# EAGLE design generic_maxi_speed_1 (EAGLE 6.3)
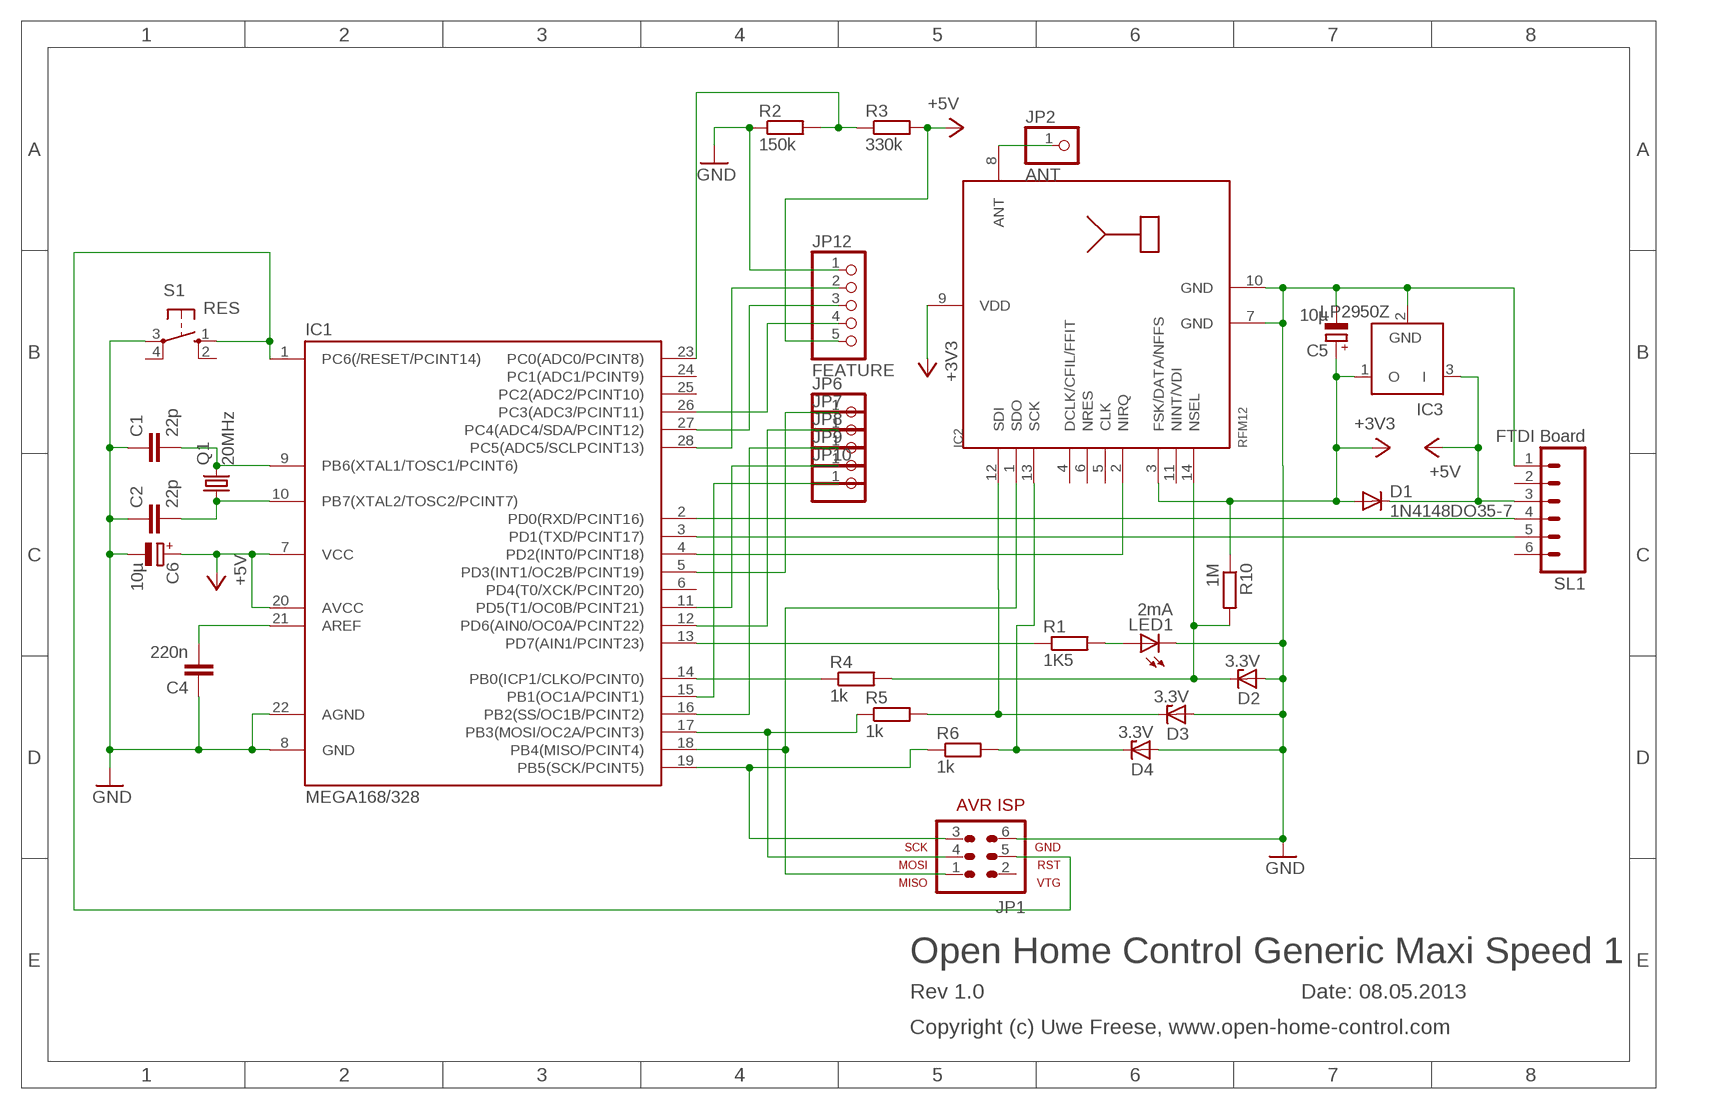
[diagram p0: schematic, sheet 1]

## Parts
C1  22p  C-EU025-024X044  [C025-024X044]
C2  22p  C-EU025-024X044  [C025-024X044]
C4  220n  C-EU025-030X050  [C025-030X050]
C5  10µ  CPOL-EUE1.8-4  [E1,8-4]
C6  10µ  CPOL-EUE1.8-4  [E1,8-4]
D1  1N4148DO35-7  [DO35-7]
D2  3.3V  ZENER-DIODEZD-5  [ZDIO-5]
D3  3.3V  ZENER-DIODEZD-5  [ZDIO-5]
D4  3.3V  ZENER-DIODEZD-5  [ZDIO-5]
IC1  MEGA168/328  MEGA48/88/168-PU  [DIL28-3]
IC2  RFM12  [RFM]
IC3  LP2950Z  [TO92]
JP1  AVR-ISP-6  [AVR-ISP-6]
JP2  ANT  PINHD-1X1  [1X01]
JP6  PINHD-1X1  [1X01]
JP7  PINHD-1X1  [1X01]
JP8  PINHD-1X1  [1X01]
JP9  PINHD-1X1  [1X01]
JP10  PINHD-1X1  [1X01]
JP12  FEATURE  PINHD-1X5  [1X05]
LED1  2mA  LED3MM  [LED3MM]
Q1  20MHz  CRYSTALHC49S  [HC49/S]
R1  1K5  R-EU_0207/7  [0207/7]
R2  150k  R-EU_0207/7  [0207/7]
R3  330k  R-EU_0207/7  [0207/7]
R4  1k  R-EU_0207/7  [0207/7]
R5  1k  R-EU_0207/7  [0207/7]
R6  1k  R-EU_0207/7  [0207/7]
R10  1M  R-EU_0207/7  [0207/7]
S1  RES  10-XX  [B3F-10XX]
SL1  FTDI Board  M06  [06P]

## Nets
+3V3: C5.+ D1.A IC2.3(FSK/DATA/NFFS) IC2.9(VDD) IC3.1(O) R10.1
+5V: C6.+ D1.C IC1.7(VCC) IC1.20(AVCC) IC3.3(I) JP12.5 R3.2 SL1.3
GND: C1.1 C2.1 C4.1 C5.- C6.- D2.A D3.A D4.A IC1.8(GND) IC1.22(AGND) IC2.7(GND) IC2.10(GND) IC3.2(GND) JP1.6 JP12.1 LED1.K(C) R2.1 S1.3(P) SL1.1
N$1: C1.2 IC1.9(PB6(XTAL1/TOSC1/PCINT6)) Q1.2
N$2: C2.2 IC1.10(PB7(XTAL2/TOSC2/PCINT7)) Q1.1
N$3: IC1.17(PB3(MOSI/OC2A/PCINT3)) JP1.4 R5.1
N$4: IC1.18(PB4(MISO/PCINT4)) IC2.1(SDO) JP1.1
N$5: D4.C IC2.13(SCK) R6.2
N$6: IC1.28(PC5(ADC5/SCLPCINT13)) JP12.2
N$7: IC1.19(PB5(SCK/PCINT5)) JP1.3 R6.1
N$8: IC1.1(PC6(/RESET/PCINT14)) JP1.5 S1.1(S)
N$9: IC1.3(PD1(TXD/PCINT17)) SL1.5
N$10: IC1.2(PD0(RXD/PCINT16)) SL1.4
N$11: IC1.27(PC4(ADC4/SDA/PCINT12)) JP12.3
N$12: LED1.A R1.2
N$14: IC1.26(PC3(ADC3/PCINT11)) JP12.4
N$15: IC1.4(PD2(INT0/PCINT18)) IC2.2(NIRQ)
N$16: D3.C IC2.12(SDI) R5.2
N$17: IC1.5(PD3(INT1/OC2B/PCINT19)) JP6.1
N$18: IC1.23(PC0(ADC0/PCINT8)) R2.2 R3.1
N$19: IC1.11(PD5(T1/OC0B/PCINT21)) JP9.1
N$20: IC1.12(PD6(AIN0/OC0A/PCINT22)) JP7.1
N$21: IC1.13(PD7(AIN1/PCINT23)) R1.1
N$22: IC1.15(PB1(OC1A/PCINT1)) JP10.1
N$23: IC1.16(PB2(SS/OC1B/PCINT2)) JP8.1
N$24: C4.2 IC1.21(AREF)
N$25: IC2.8(ANT) JP2.1
N$26: IC1.14(PB0(ICP1/CLKO/PCINT0)) R4.1
N$27: D2.C IC2.14(NSEL) R4.2 R10.2
Unconnected: IC1.6(PD4(T0/XCK/PCINT20)) IC1.24(PC1(ADC1/PCINT9)) IC1.25(PC2(ADC2/PCINT10)) IC2.4(DCLK/CFIL/FFIT) IC2.5(CLK) IC2.6(NRES) IC2.11(NINT/VDI) JP1.2 S1.2(S1) S1.4(P1) SL1.2 SL1.6

## Notes on the sheet
- Open Home Control Generic Maxi Speed 1
- Rev 1.0 | Date: 08.05.2013
- Copyright (c) Uwe Freese, www.open-home-control.com

## Library data of the parts
C1 C2 C4 = rcl:C-EU: CAPACITOR, European symbol
C5 C6 = rcl:CPOL-EU: POLARIZED CAPACITOR, European symbol
D1 = diode:1N4148: DIODE high speed (Philips)
D2-D4 = diode:ZENER-DIODE: Z-Diode
IC1 = avr-5-4.16:MEGA48/88/168-PU
IC2 = hopeRF:RFM12
IC3 = linear:LP2950: 100 mA, Low Power Low Dropout Voltage Regulator Source: http://www.onsemi.com/pub/Collateral/LP2950-D.PDF
JP1 = avr-5-4.16:AVR-ISP-6: AVR ISP-6 Serial Programming Header
JP2 JP6-JP10 = pinhead:PINHD-1X1: PIN HEADER
JP12 = pinhead:PINHD-1X5: PIN HEADER
LED1 = led:LED: LED OSRAM: - CHIPLED LG R971, LG N971, LY N971, LG Q971, LY Q971, LO R971, LY R971 LH N974, LH R974 LS Q976, LO Q976, LY Q976 LO Q996 - Hyper CHIPLED LW Q18S LB Q993, LB Q99A, LB R99A - SideLED LS A670, LO A670, LY A670, LG A670, LP A670 LB A673, LV A673, LT A673, LW A673 LH A674 LY A675 LS A676, LA A676, LO A676, LY A676, LW A676 LS A679, LY A679, LG A679 - Hyper Micro SIDELED® LS Y876, LA Y876, LO Y876, LY Y876 LT Y87S - SmartLED LW L88C, LW L88S LB L89C, LB L89S, LG L890 LS L89K, LO L89K, LY L89K LS L896, LA L896, LO L896, LY L896 - TOPLED LS T670, LO T670, LY T670, LG T670, LP T670 LSG T670, LSP T670, LSY T670, LOP T670, LYG T670 LG T671, LOG T671, LSG T671 LB T673, LV T673, LT T673, LW T673 LH T674 LS T676, LA T676, LO T676, LY T676, LB T676, LH T676, LSB T676, LW T676 LB T67C, LV T67C, LT T67C, LS T67K, LO T67K, LY T67K, LW E67C LS E67B, LA E67B, LO E67B, LY E67B, LB E67C, LV E67C, LT E67C LW T67C LS T679, LY T679, LG T679 LS T770, LO T770, LY T770, LG T770, LP T770 LB T773, LV T773, LT T773, LW T773 LH T774 LS E675, LA E675, LY E675, LS T675 LS T776, LA T776, LO T776, LY T776, LB T776 LHGB T686 LT T68C, LB T68C - Hyper Mini TOPLED® LB M676 - Mini TOPLED Santana® LG M470 LS M47K, LO M47K, LY M47K Source: http://www.osram.convergy.de LUXEON: - LUMILED® LXK2-PW12-R00, LXK2-PW12-S00, LXK2-PW14-U00, LXK2-PW14-V00 LXK2-PM12-R00, LXK2-PM12-S00, LXK2-PM14-U00 LXK2-PE12-Q00, LXK2-PE12-R00, LXK2-PE12-S00, LXK2-PE14-T00, LXK2-PE14-U00 LXK2-PB12-K00, LXK2-PB12-L00, LXK2-PB12-M00, LXK2-PB14-N00, LXK2-PB14-P00, LXK2-PB14-Q00 LXK2-PR12-L00, LXK2-PR12-M00, LXK2-PR14-Q00, LXK2-PR14-R00 LXK2-PD12-Q00, LXK2-PD12-R00, LXK2-PD12-S00 LXK2-PH12-R00, LXK2-PH12-S00 LXK2-PL12-P00, LXK2-PL12-Q00, LXK2-PL12-R00 Source: www.luxeon.com KINGBRIGHT: KA-3528ASYC Source: www.kingbright.com
Q1 = crystal:CRYSTAL: CRYSTAL; OC_FARNELL: 1667008; OC_NEWARK: unknown
R1-R6 R10 = rcl:R-EU_: RESISTOR, European symbol
S1 = switch-omron:10-XX: OMRON SWITCH; MPN: B3F-1000; OC_FARNELL: 176432; OC_NEWARK: 36M3542
SL1 = con-amp-quick:M06: AMP QUICK CONNECTOR; OC_FARNELL: unknown; OC_NEWARK: unknown

## Net classes
0 default: clearance 0.305 mm

## Board
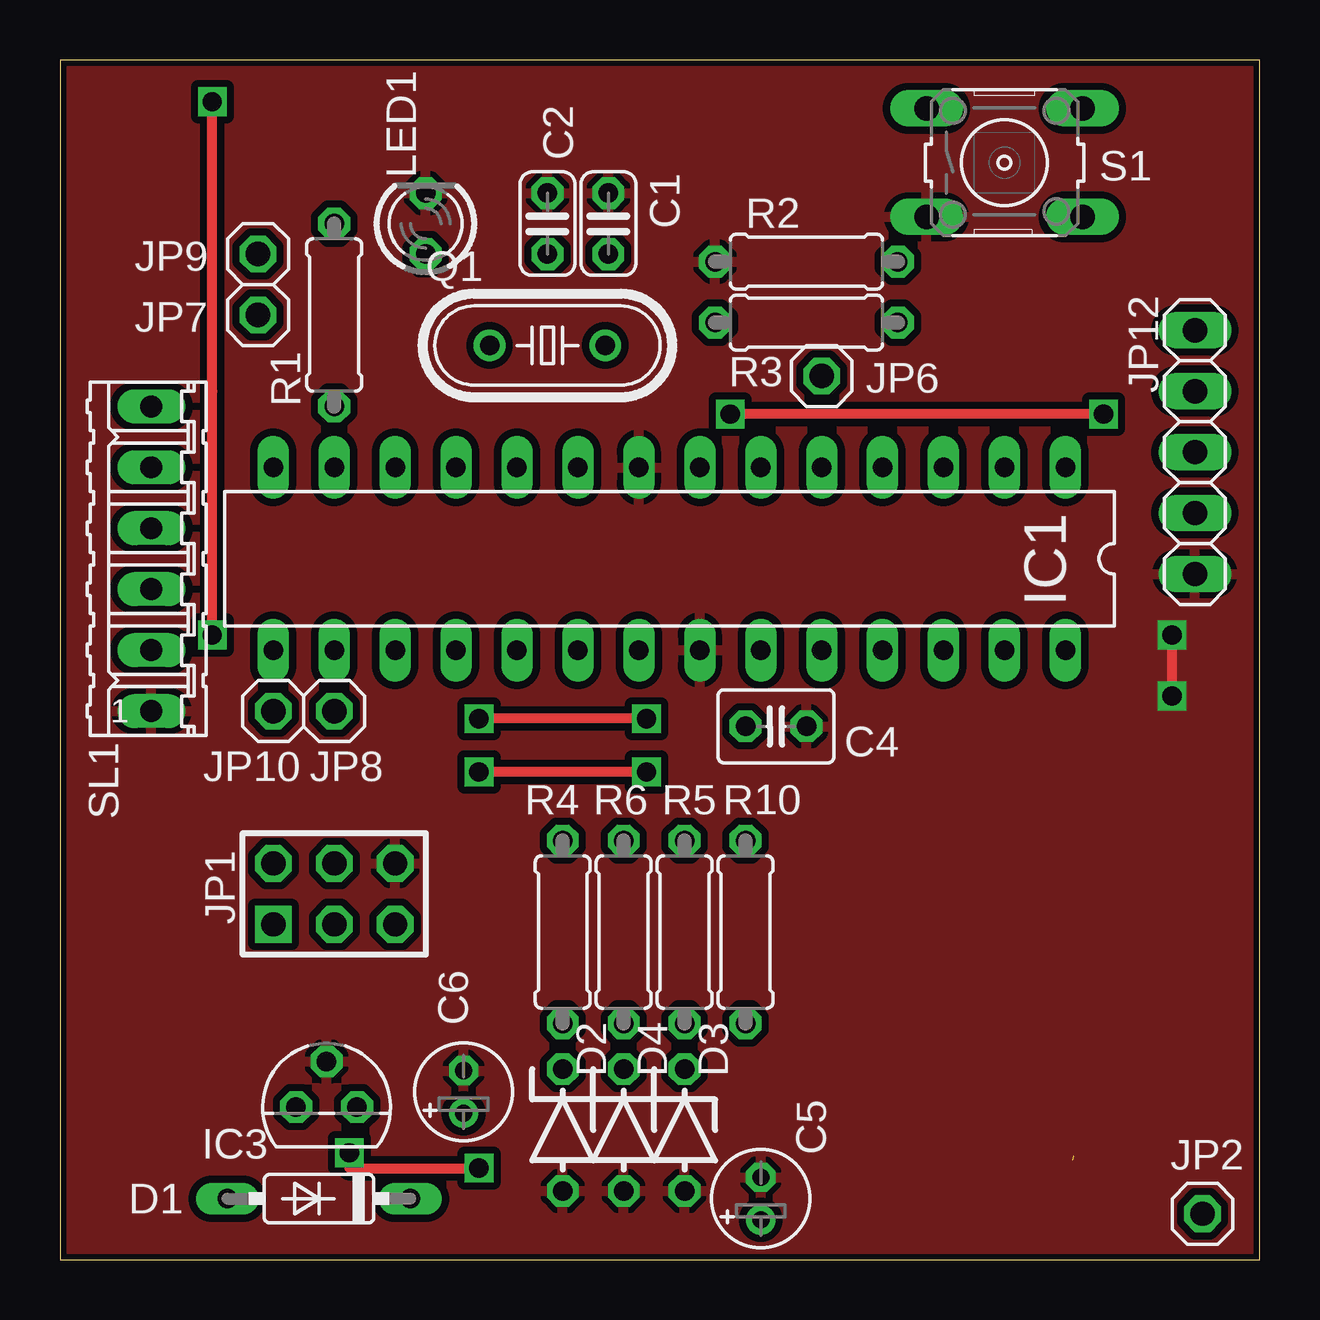
[diagram p1: board, top side]
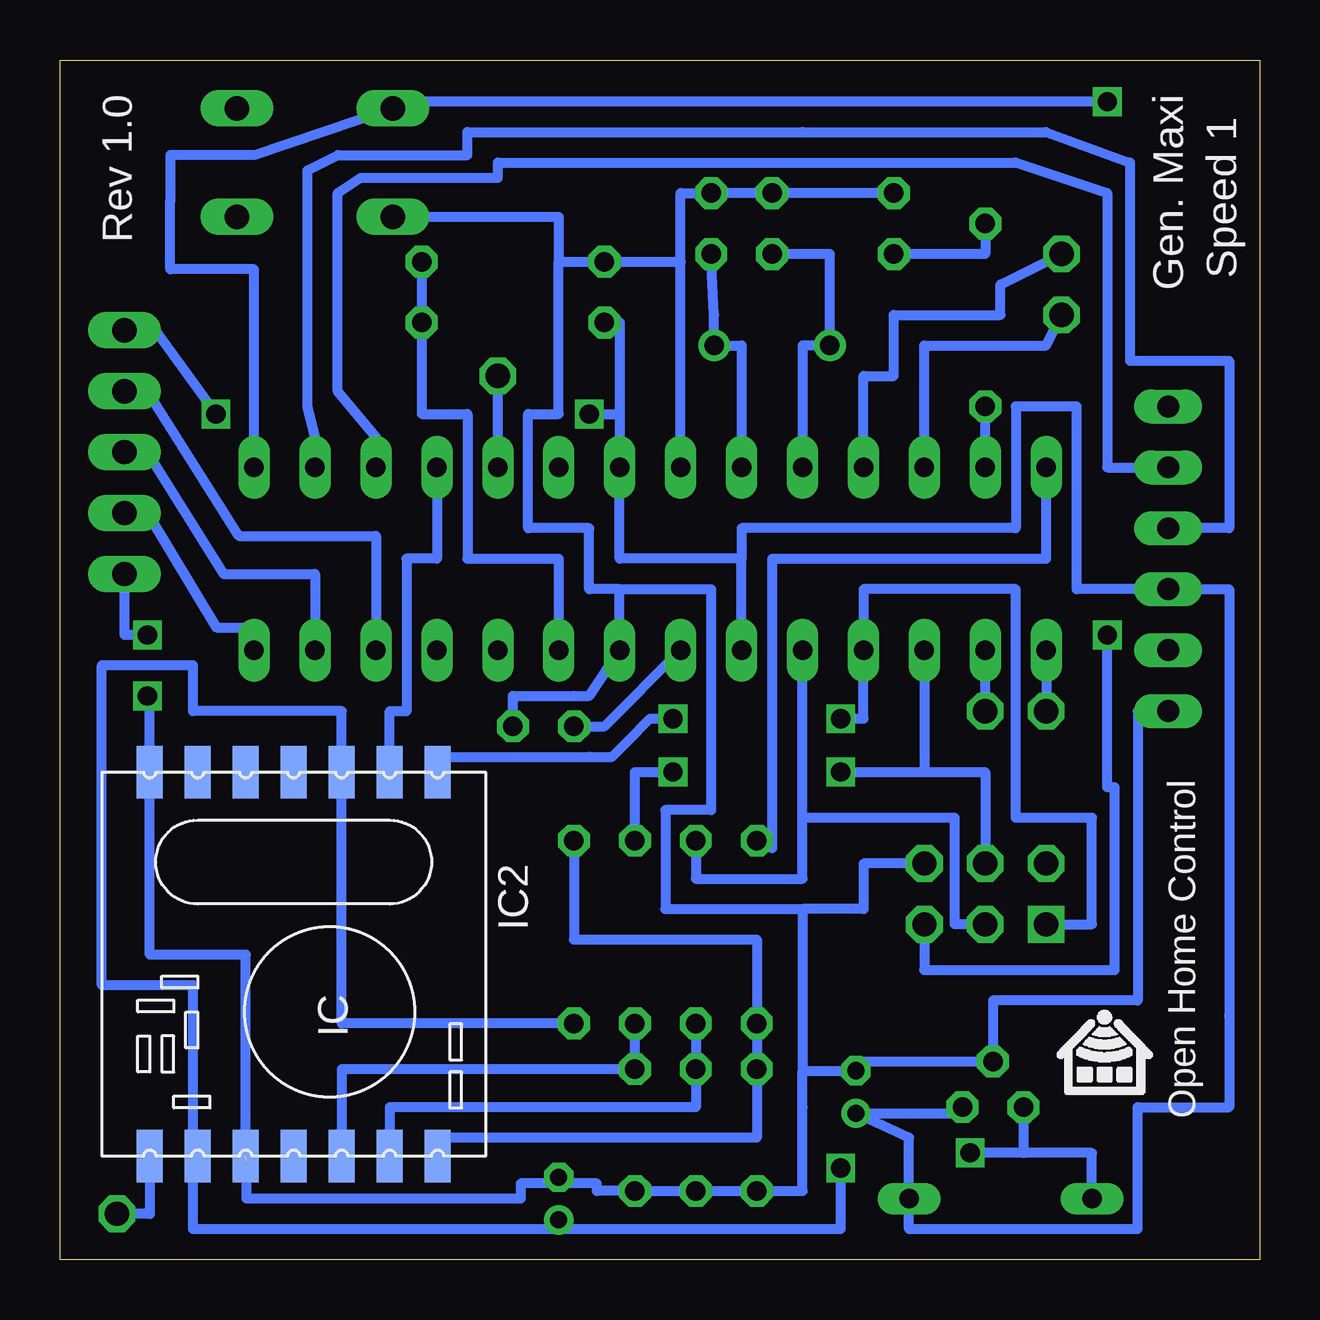
[diagram p2: board, bottom side, seen from below]

Size 50 x 50 mm. Coordinates in mm from the lower left corner, seen from the top.
Outline: 0,0 50,0 50,50 0,50 0,0
Copper layers (1*16): Top 0.035mm / dielectric 1.5mm / Bottom 0.035mm
Design rules "Fusion_eagle_rule_v1.1": minimum track width 6mil, minimum drill 12mil, track to track 6mil, track to pad 6mil, pad to pad 6mil, via to via 6mil, smd to smd 0mil, copper to edge 10mil, drill to drill 10mil, minimum pad ring 10mil, minimum via ring 6mil, stop-mask expansion 2mil, vias tented up to drill 100mil, thermal gap 10mil

### Footprints (pad centres in the part's own frame; a part is rotated, then mirrored left to right if it is on the bottom)
C025-024X044 = drill 0.813 octagon: 1 -1.27,0; 2 1.27,0
C025-030X050 = drill 0.813 octagon: 1 -1.27,0; 2 1.27,0
E1,8-4 = drill 0.711 pad 1.168: + -0.889,0 | drill 0.711 pad 1.168 octagon: - 0.889,0
DO35-7 = drill 0.813 long: A 3.81,0; C -3.81,0
ZDIO-5 = drill 0.813 octagon: A 2.54,0; C -2.54,0
DIL28-3 = drill 0.813 long: 1 -16.51,-3.81; 2 -13.97,-3.81; 3 -11.43,-3.81; 4 -8.89,-3.81; 5 -6.35,-3.81; 6 -3.81,-3.81; 7 -1.27,-3.81; 8 1.27,-3.81; 9 3.81,-3.81; 10 6.35,-3.81; 11 8.89,-3.81; 12 11.43,-3.81; 13 13.97,-3.81; 14 16.51,-3.81; 15 16.51,3.81; 16 13.97,3.81; 17 11.43,3.81; 18 8.89,3.81; 19 6.35,3.81; 20 3.81,3.81; 21 1.27,3.81; 22 -1.27,3.81; 23 -3.81,3.81; 24 -6.35,3.81; 25 -8.89,3.81; 26 -11.43,3.81; 27 -13.97,3.81; 28 -16.51,3.81
RFM = smd 2.184 x 1.067: 1 0,14; 2 0,12; 3 0,10; 4 0,8; 5 0,6; 6 0,4; 7 0,2; 8 16,2; 9 16,4; 10 16,6; 11 16,8; 12 16,10; 13 16,12; 14 16,14
TO92 = drill 0.813 octagon: 1 -1.27,0; 2 0,1.905; 3 1.27,0
AVR-ISP-6 = drill 1.016 square: 1 -2.54,-1.27 | drill 1.016 octagon: 2 -2.54,1.27; 3 0,-1.27; 4 0,1.27; 5 2.54,-1.27; 6 2.54,1.27
1X01 = drill 1.016 octagon: 1 0,0
1X05 = drill 1.016 long: 1 -5.08,0; 2 -2.54,0; 3 0,0; 4 2.54,0; 5 5.08,0
LED3MM = drill 0.813 octagon: A -1.27,0; K 1.27,0
HC49/S = drill 0.813: 1 -2.413,0; 2 2.413,0
0207/7 = drill 0.813 octagon: 1 -3.81,0; 2 3.81,0
B3F-10XX = drill 1.016 long: 1 -3.251,2.261; 2 3.251,2.261; 3 -3.251,-2.261; 4 3.251,-2.261
06P = drill 0.914 long: 1 -6.35,0; 2 -3.81,0; 3 -1.27,0; 4 1.27,0; 5 3.81,0; 6 6.35,0

### Placement (x,y rotation side)
C1  22.86,43.18 270 top
C2  20.32,43.18 270 top
C4  29.84,22.23 180 top
C5  29.21,2.54 90 top
C6  16.83,6.99 90 top
D1  10.79,2.54 180 top
D2  20.95,5.4 270 top
D3  26.04,5.4 270 top
D4  23.5,5.4 270 top
IC1  25.4,29.21 180 top
IC2  48.26,20.32 270 bottom
IC3  11.11,6.35 0 top
JP1  11.43,15.24 0 top
JP2  47.62,1.91 0 top
JP6  31.75,36.83 0 top
JP7  8.26,39.37 0 top
JP8  11.43,22.86 0 top
JP9  8.26,41.91 0 top
JP10  8.89,22.86 0 top
JP12  47.31,33.66 90 top
LED1  15.24,43.18 90 top
Q1  20.32,38.1 0 top
R1  11.43,39.37 90 top
R2  31.11,41.59 0 top
R3  31.11,39.05 180 top
R4  20.95,13.65 270 top
R5  26.04,13.65 270 top
R6  23.5,13.65 270 top
R10  28.57,13.65 90 top
S1  39.37,45.72 0 top
SL1  3.81,29.21 90 top

### Tracks (layer width: path | path; a pad name or v marks a point on that pad's centre or on a via)
+3V3  (via drill 0.8)
  Top 0.406: v12.06,4.45 12.06,3.81 v17.46,3.81
  Bottom 0.406: 44.45,4.32 IC2.9 44.45,4.32 | 44.45,4.32 44.45,11.43 48.26,11.43 48.26,24.77 44.45,24.77 44.45,22.86 38.26,22.86 IC2.3 38.26,9.84 R10.1 | IC3.1 9.84,4.45 | 9.84,4.45 v12.06,4.45 | v17.46,3.81 17.46,1.27 29.21,1.27 | 44.45,4.32 44.45,1.27 29.21,1.27 | 29.21,1.27 C5.+ 29.21,1.27 | D1.A 6.99,4.45 9.84,4.45
+5V  (via drill 0.8)
  Top 0.406: v43.5,35.24 v27.94,35.24
  Bottom 0.406: IC3.3 12.38,6.1 C6.+ 14.61,5.08 D1.C 14.61,1.27 5.08,1.27 5.08,6.35 1.27,6.35 1.27,10.16 1.27,27.94 SL1.3 7.62,27.94 7.62,35.56 10.16,35.56 10.16,30.48 21.59,30.48 21.59,29.21 | IC1.20 21.59,29.21 | 21.59,29.21 26.67,29.21 IC1.7 26.67,35.24 | R3.2 26.67,39.05 26.67,35.24 | JP12.5 46.04,38.73 v43.5,35.24 | v27.94,35.24 26.67,35.24
GND  (via drill 0.8)  (1 unrouted)
  Top 0.406: v46.35,23.5 v46.35,26.04
  Bottom 0.406: IC1.8 24.13,41.59 | 24.13,41.59 24.13,44.45 C1.1 C2.1 16.51,44.45 LED1.K | IC2.10 42.26,12.7 44.45,12.7 46.26,12.7 IC2.7 46.26,23.4 v46.35,23.5 | SL1.1 4.45,22.86 5.08,22.86 5.08,10.79 11.11,10.79 IC3.2 16.83,8.26 C6.- 19.05,7.87 | 19.05,7.87 19.05,6.35 19.05,2.86 D2.A D4.A D3.A 27.62,2.86 27.62,3.17 29.21,3.17 | 19.05,14.61 19.05,7.87 | 19.05,14.61 24.77,14.61 24.77,18.73 22.86,18.73 22.86,27.94 26.67,27.94 | 24.13,41.59 R2.1 29.21,41.59 | IC1.22 26.67,27.94 | 26.67,27.94 27.94,27.94 27.94,30.48 30.48,30.48 30.48,35.24 29.21,35.24 29.21,41.59 | IC1.22 26.67,27.94 | C4.1 31.11,23.5 28.57,23.5 27.94,23.5 IC1.22 | v46.35,26.04 47.31,26.04 JP12.1 | 42.23,4.13 42.23,2.54 30.8,2.54 30.8,3.17 29.21,3.17 | JP1.6 16.51,16.51 16.51,14.61 19.05,14.61 | 29.21,3.17 C5.- 29.21,3.17 | S1.3 29.21,43.46 29.21,41.59
  pour Top: 0,0 49.85,0 49.85,50.16 0,50.16
N$1
  Bottom 0.406: IC1.9 21.59,38.1 Q1.2 22.73,39.37 C1.2
N$2
  Bottom 0.406: IC1.10 19.05,38.1 Q1.1 17.91,41.91 C2.2
N$3  (via drill 0.8)
  Top 0.406: v24.45,20.32 v17.46,20.32
  Bottom 0.406: IC1.17 13.97,20.32 | 13.97,20.32 11.43,20.32 JP1.4 | R5.1 26.04,20 26.04,20.32 v24.45,20.32 | v17.46,20.32 13.97,20.32
N$4  (via drill 0.8)
  Top 0.406: v24.45,22.54 v17.46,22.54
  Bottom 0.406: JP1.1 6.99,13.97 6.99,18.41 10.16,18.41 10.16,27.94 16.51,27.94 IC1.18 16.51,22.54 v17.46,22.54 | IC2.1 34.26,20.95 27.94,20.95 26.99,20.95 26.35,21.59 25.4,22.54 v24.45,22.54
N$5
  Bottom 0.406: IC2.13 36.26,6.35 34.29,6.35 23.5,6.35 D4.C R6.2
N$6
  Bottom 0.406: JP12.2 46.35,31.11 43.5,26.35 41.91,26.35 IC1.28
N$7
  Bottom 0.406: JP1.3 12.7,13.97 12.7,18.41 19.05,18.41 | 19.05,18.41 IC1.19 | R6.1 23.5,15.88 19.05,15.88 19.05,18.41
N$8  (via drill 0.8)
  Top 0.406: v6.35,26.04 6.35,36.2 v6.35,48.26
  Bottom 0.406: JP1.5 13.97,12.06 6.03,12.06 6.03,19.68 6.35,19.68 v6.35,26.04 | IC1.1 41.91,41.27 45.4,41.27 45.4,44.13 45.4,46.04 41.91,46.04 S1.1 arc90 35.84,48.26 v6.35,48.26
N$9
  Bottom 0.406: IC1.3 36.83,34.29 38.42,36.2 38.42,44.45 37.47,45.09 31.75,45.09 31.75,45.72 10.16,45.72 6.35,44.45 6.35,33.02 SL1.5
N$10
  Bottom 0.406: SL1.4 1.27,30.48 1.27,37.47 5.4,37.47 5.4,45.72 8.89,46.99 19.05,46.99 33.02,46.99 33.02,46.04 38.42,46.04 39.69,45.4 39.69,35.56 39.37,34.29 IC1.2
N$11
  Bottom 0.406: JP12.3 46.35,33.66 43.18,28.57 39.37,28.57 IC1.27
N$12
  Bottom 0.406: R1.2 11.43,41.91 LED1.A
N$14
  Bottom 0.406: JP12.4 46.35,36.2 42.55,30.16 36.83,30.16 IC1.26
N$15
  Bottom 0.406: IC1.4 34.29,29.21 35.56,29.21 35.56,22.86 36.26,22.86 IC2.2
N$16
  Bottom 0.406: IC2.12 38.26,7.62 38.26,7.94 D3.C R5.2
N$17
  Bottom 0.406: IC1.5 JP6.1
N$18
  Bottom 0.406: IC1.23 29.21,29.21 33.02,29.21 33.02,35.24 34.92,35.24 R3.1 R2.2
N$19
  Bottom 0.406: IC1.11 16.51,36.83 15.24,36.83 15.24,39.37 10.79,39.37 10.79,40.64 JP9.1
N$20
  Bottom 0.406: IC1.12 13.97,38.1 8.89,38.1 JP7.1
N$21
  Bottom 0.406: IC1.13 R1.1
N$22
  Bottom 0.406: IC1.15 JP10.1
N$23
  Bottom 0.406: JP8.1 IC1.16
N$24
  Bottom 0.406: C4.2 27.3,22.23 IC1.21
N$25
  Bottom 0.406: IC2.8 46.26,1.91 JP2.1
N$26
  Bottom 0.406: IC1.14 8.89,29.21 20.32,29.21 20.32,17.14 R4.1
N$27
  Bottom 0.406: R10.2 28.57,13.34 20.95,13.34 R4.2 D2.C 20.95,5.08 34.29,5.08 34.29,4.32 IC2.14

### Text on the board
bNames: Gen. Maxi | Rev 1.0 | Speed 1 | Open Home Control